# EAGLE design gba-zero (EAGLE 9.0.0)
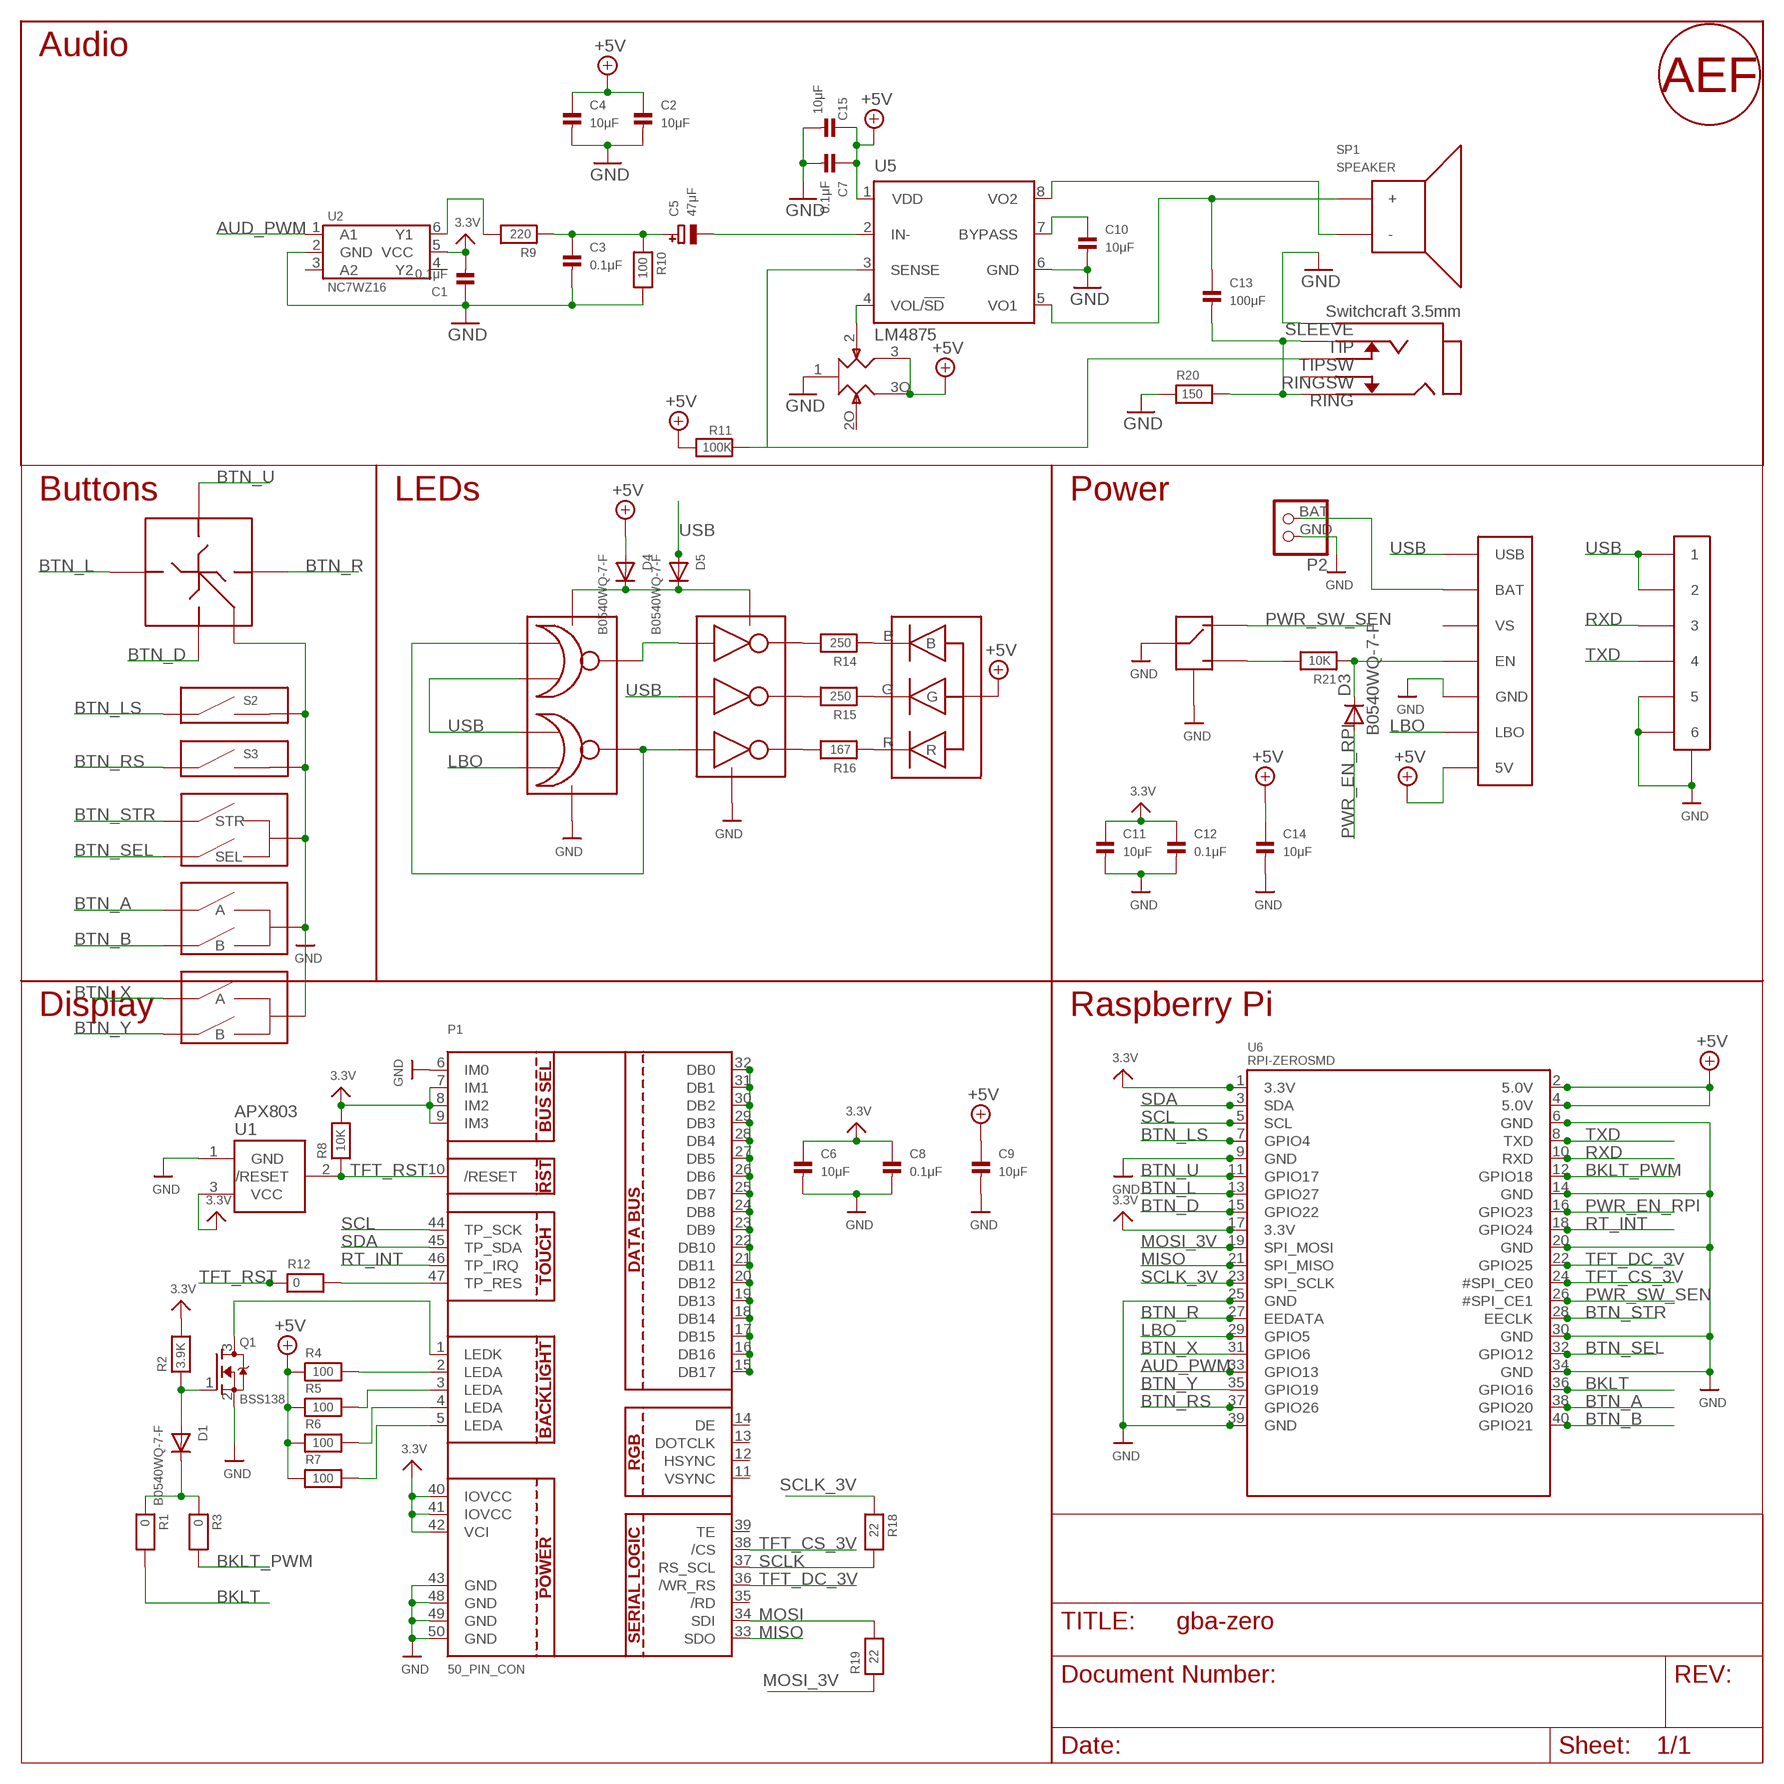
[diagram p0: schematic, sheet 1]

## Parts
C1  0.1μF  CAP_CERAMIC0603  [0603]
C2  10μF  CAP_CERAMIC0603  [0603]
C3  0.1μF  CAP_CERAMIC0603  [0603]
C4  10μF  CAP_CERAMIC0603  [0603]
C5  47μF  CAP_TANTALUMC/6032_REFLOW  [EIA6032-28/C-R]
C6  10μF  CAP_CERAMIC0603  [0603]
C7  0.1μF  CAP_CERAMIC0603  [0603]
C8  0.1μF  CAP_CERAMIC0603  [0603]
C9  10μF  CAP_CERAMIC0603  [0603]
C10  10μF  CAP_CERAMIC0603  [0603]
C11  10μF  CAP_CERAMIC0603  [0603]
C12  0.1μF  CAP_CERAMIC0603  [0603]
C13  100μF  CAP_CERAMIC1206  [1206]
C14  10μF  CAP_CERAMIC0603  [0603]
C15  10μF  CAP_CERAMIC0603  [0603]
D1  B0540WQ-7-F  DIODESOD-123  [SOD-123]
D2  LTST-C19HE1WT  [WL-SBCW-0606]
D3  B0540WQ-7-F  DIODESOD-123  [SOD-123]
D4  B0540WQ-7-F  DIODESOD-123  [SOD-123]
D5  B0540WQ-7-F  DIODESOD-123  [SOD-123]
J1  SWTCHCRFT_3.5JACK5-JACK-SMD  [4-JACK-SMD]
P1  50_PIN_CON  DISP_LCD_CTP28  [FPC-50-CON]
P2  JST_2PIN  [JSTPH2]
P3  LINK_CONNECTOR  [LINK_CONNECTOR]
Q1  BSS138  MOSFET-NWIDE  [SOT23-WIDE]
R1  0  RESISTOR0603  [0603]
R2  3.9K  RESISTOR0603  [0603]
R3  0  RESISTOR0603  [0603]
R4  100  RESISTOR0603  [0603]
R5  100  RESISTOR0603  [0603]
R6  100  RESISTOR0603  [0603]
R7  100  RESISTOR0603  [0603]
R8  10K  RESISTOR0603  [0603]
R9  220  RESISTOR0603  [0603]
R10  100  RESISTOR0603  [0603]
R11  100K  RESISTOR0603  [0603]
R12  0  RESISTOR0603  [0603]
R14  250  RESISTOR0603  [0603]
R15  250  RESISTOR0603  [0603]
R16  167  RESISTOR0603  [0603]
R17  10K  RK10J12E0A0A  [RK10J12E0A0A]
R18  22  RESISTOR0603  [0603]
R19  22  RESISTOR0603  [0603]
R20  150  RESISTOR0603  [0603]
R21  10K  RESISTOR0603  [0603]
S1  D-PAD  [D-PAD]
S2  SHOULDER_BUTTON  [SHOULDER_BUTTON]
S3  SHOULDER_BUTTON  [SHOULDER_BUTTON]
S4  START_SELECT_BUTTON  [START_SELECT_BUTTON]
S5  AB_BUTTON  [AB_BUTTON]
S6  PWR_SWITCH  [PWR-SWITCH]
S7  AB_BUTTON  [AB_BUTTON]
SP1  SPEAKER  [SPEAKER]
U1  APX803  AXP083-SAG  [SOT23]
U2  NC7WZ16  [SC-70-6]
U3  74LVC2G02  [TSSOP-8]
U4  74LVC3G04  [TSSOP-8]
U5  LM4875  [SO-8]
U6  RPI-ZEROSMD  [RPI-SMD]
U7  POWERBOOST-1000C  [POWERBOOST-1000C]
U$1  SIGNATURE  [SIGNATURE]

## Nets
3.3V: C1.2 C6.1 C8.1 C11.1 C12.1 P1.7(IM1) P1.8(IM2) P1.9(IM3) P1.40(IOVCC) P1.41(IOVCC) P1.42(VCI) R2.2 R8.2 U1.3(VCC) U2.5(VCC) U6.1(3.3V) U6.17(3.3V)
+5V: C2.1 C4.1 C7.1 C9.1 C14.1 C15.1 D2.VCC D4.A R4.1 R5.1 R6.1 R7.1 R11.2 R17.3 R17.3O U5.1(VDD) U6.2(5.0V) U6.4(5.0V) U7.5V
AUD_PWM: U2.1(A1) U6.33(GPIO13)
BAT: P2.BAT U7.BAT
BKLT: R1.2 U6.36(GPIO16)
BKLT_PWM: R3.2 U6.12(GPIO18)
BTN_A: S5.A@1(A) S5.A@2(A) U6.38(GPIO20)
BTN_B: S5.B@1(B) S5.B@2(B) U6.40(GPIO21)
BTN_D: S1.DOWN U6.15(GPIO22)
BTN_L: S1.LEFT U6.13(GPIO27)
BTN_LS: S2.SW U6.7(GPIO4)
BTN_R: S1.RIGHT U6.27(EEDATA)
BTN_RS: S3.SW U6.37(GPIO26)
BTN_SEL: S4.SEL U6.32(GPIO12)
BTN_STR: S4.STR U6.28(EECLK)
BTN_U: S1.UP U6.11(GPIO17)
BTN_X: S7.A@1(A) S7.A@2(A) U6.31(GPIO6)
BTN_Y: S7.B@1(B) S7.B@2(B) U6.35(GPIO19)
BYPASS: C10.1 U5.7(BYPASS)
GND: C1.1 C2.2 C3.2 C4.2 C6.2 C7.2 C8.2 C9.2 C10.2 C11.2 C12.2 C14.2 C15.2 J1.1 P1.6(IM0) P1.43(GND) P1.48(GND) P1.49(GND) P1.50(GND) P2.GND P3.5 P3.6 P3.GND@1(GND) P3.GND@2(GND) Q1.2(S) R10.2 R17.1 R20.1 S1.GND@1(GND) S1.GND@2(GND) S1.GND@3(GND) S1.GND@4(GND) S2.GND@1 S2.GND@2 S2.GND@3 S3.GND@1 S3.GND@2 S3.GND@3 S4.GND@1(GND) S4.GND@2(GND) S4.GND@3(GND) S4.GND@4(GND) S5.GND@1(GND) S5.GND@2(GND) S5.GND@3(GND) S5.GND@4(GND) S6.C@1(C) S6.C@2(C) S6.GND@1(GND) S6.GND@2(GND) S7.GND@1(GND) S7.GND@2(GND) S7.GND@3(GND) S7.GND@4(GND) U1.1(GND) U2.2(GND) U3.4(GND) U4.4(GND) U5.6(GND) U6.6(GND) U6.9(GND) U6.14(GND) U6.20(GND) U6.25(GND) U6.30(GND) U6.34(GND) U6.39(GND) U7.GND@1(GND) U7.GND@2(GND)
LBO: U3.6(2B) U6.29(GPIO5) U7.LBO
MISO: P1.33(SDO) U6.21(SPI_MISO)
MOSI: P1.34(SDI) R19.2
MOSI_3V: R19.1 U6.19(SPI_MOSI)
N$1: P1.1(LEDK) Q1.3(D)
N$2: P1.5(LEDA) R7.2
N$3: P1.4(LEDA) R6.2
N$4: P1.3(LEDA) R5.2
N$5: R16.2 U4.2(3Y)
N$6: D1.C R1.1 R3.1
N$7: D1.A Q1.1(G) R2.1
N$8: D2.R R16.1
N$9: P1.15(DB17) P1.16(DB16) P1.17(DB15) P1.18(DB14) P1.19(DB13) P1.20(DB12) P1.21(DB11) P1.22(DB10) P1.23(DB9) P1.24(DB8) P1.25(DB7) P1.26(DB6) P1.27(DB5) P1.28(DB4) P1.29(DB3) P1.30(DB2) P1.31(DB1) P1.32(DB0)
N$10: P1.2(LEDA) R4.2
N$11: R15.2 U4.5(2Y)
N$12: D2.G R15.1
N$13: R14.2 U4.7(1Y)
N$14: D2.B R14.1
N$15: U3.7(1Y) U4.1(1A)
N$16: U3.1(1A) U3.3(2Y) U4.6(3A)
N$17: R21.2 S6.R
N$18: D3.C R21.1 U7.EN
N$19: D4.C D5.C U3.8(VCC) U4.8(VCC)
N$20: R9.2 U2.6(Y1)
N$21: C3.1 C5.+ R9.1 R10.1
N$22: P1.47(TP_RES) R12.2
N$23: C5.- U5.2(IN-)
PWR_EN_RPI: D3.A U6.16(GPIO23)
PWR_SW_SEN: S6.L U6.26(#SPI_CE1)
RING: C13.2 J1.2 J1.3 R20.2
RT_INT: P1.46(TP_IRQ) U6.18(GPIO24)
RXD: P3.3 U6.10(RXD)
SCL: P1.44(TP_SCK) U6.5(SCL)
SCLK: P1.37(RS_SCL) R18.2
SCLK_3V: R18.1 U6.23(SPI_SCLK)
SDA: P1.45(TP_SDA) U6.3(SDA)
SENSE: J1.5 R11.1 U5.3(SENSE)
TFT_CS_3V: P1.38(/CS) U6.24(#SPI_CE0)
TFT_DC_3V: P1.36(/WR_RS) U6.22(GPIO25)
TFT_RST: P1.10(/RESET) R8.1 R12.1 U1.2(/RESET)
TXD: P3.4 U6.8(TXD)
USB: D5.A P3.1 P3.2 U3.2(1B) U3.5(2A) U4.3(2A) U7.USB
VO1: C13.1 SP1.1(+) U5.5(VO1)
VO2: SP1.2(-) U5.8(VO2)
VOL/SD: R17.2 U5.4(VOL/!SD)
Unconnected: J1.4 P1.11(VSYNC) P1.12(HSYNC) P1.13(DOTCLK) P1.14(DE) P1.35(/RD) P1.39(TE) R17.2O U2.3(A2) U2.4(Y2) U7.VS

## Notes on the sheet
- Audio
- Buttons | LEDs | Power
- Display | Raspberry Pi

## Library data of the parts
C1-C4 C6-C15 = microbuilder:CAP_CERAMIC: Ceramic Capacitors 0402 - 0402 Surface Mount Capacitors 16pF 50V 5% [Digikey: 445-4899-2-ND] 18pF 50V 5% [Digikey: 490-1281-2-ND] 22pF 50V 5% [Digikey: 490-1283-2-ND] 68pF 50V 5% [Digikey: 490-1289-2-ND] 0.1uF 10V 10% [Digikey: 490-1318-2-ND] 1.0uF 6.3V 10% [Digikey: 490-1320-2-ND] 0603 - 0603 Surface Mount Capacitors 16 pF 50V 5% [Digikey: 445-5051-2-ND] 22 pF 50V [Digikey: PCC220ACVTR-ND] 33 pF 50V 5% [Digikey: 490-1415-1-ND] 56pF 50V 5% [Digikey: 490-1421-1-ND] 220pF 50V 5% [Digikey: 445-1285-1-ND] 680 pF 50V 2200 pF 50V 5% C0G [Digikey: 445-1297-1-ND] 5600 pF 100V 5% X7R [Digikey: 478-3711-1-ND] 0.1 µF 25V 10% [Digikey: PCC2277TR-ND] 0.22 µF 16V 10% X7R [Digikey: 445-1318-1-ND] 1.0 µF 25V 10% [Digikey: 445-5146-2-ND] 0603 - RF Specific 3pF 250V +/-0.1pF RF [Digikey: 712-1347-1-ND] 18 pF 250V 5% [Digikey: 478-3505-1-ND or 712-1322-1-ND] 56 pF 250V 5% C0G RF [Digikey: 490-4867-1-ND] 68 pF 250V RF [Digikey: 490-4868-1-ND] 0805 - 0805 Surface Mount Capacitors 220 pF 250V 2% RF Ceramic Capacitor [Digikey: 712-1398-1-ND] 1000 pF 50V 2% NP0 Ceramic Capacitor [Digikey: 478-3760-1-ND] 0.1 µF 25V 10% Ceramic Capacitor [Digikey: PCC1828TR-ND] 1.0 µF 16V 10% Ceramic Capacitor[Digikey: 490-1691-2-ND] 10.0 µF 10V 10% Ceramic Capacitor[Digikey: 709-1228-1-ND] 10.0 uF 16V 10% Ceramic Capacitor [Digikey: 478-5165-2-ND] 47 uF 6.3V 20% Ceramic Capacitor [Digikey: 587-1779-1-ND or 399-5506-1-ND] 1206 - 1206 Surface Mount Capacitors 47uF 10V 20% Ceramic Capacitor [Digikey: 490-5528-1-ND or 399-5508-1-ND or 445-6010-1-ND] 100uF 6.3V -20%, +80% Y5V Ceramic Capacitor (Digikey: 490-4512-1-ND, Mouser: 81-GRM31CF50J107ZE1L)
C5 = microbuilder:CAP_TANTALUM: Tantalum Capacitors Wave footprints have larger pads and are meant to be used for hand soldering. Reflow footprints are optimised for solder paste and a reflow oven. EIA3216-18/A-[R/W] - Size A / 3216-18 / 1206 footprint 4.7µF 25V 10% Tantalum Capacitor 10µF 16V 10% Tantalum Capacitor [Digikey: 495-2236-2-ND] EIA3528-21/B-[R/W] - Size B / 3528-21 47µF 10V 10% Tantalum Capactior [Digikey: 495-2216-1-ND] EIA6032-28/C-[R/W] - Size C / 6032-28 10µF 35V 20% Tantalum Capacitor [Digikey: 495-2285-1-ND] 100µF 16V 10% Tantalum Capactior [Digikey: 399-5214-1-ND]
D1 D3-D5 = microbuilder:DIODE: Diode SMA Model Volts Amps Type Vf Vr Digikey # Notes SSA34-E3 40V 3A Schottky 480mV @ 3A 200uA @ 40V SSA34-E3/61TGITR-ND CDBA120-G 20V 1A Schottky 500mV @ 1A 500uA @ 20V 641-1014-6-ND REEL MBRA210 10V 2A Schottky 350mV @ 2A 700uA @ 10V MBRA210LT3 SOD-123 Model Volts Amps Type Vf Vr Order # Notes BAT54T1G 30V 200mA Schottky 800mV @ 200mA 2uA @ 25V BAT54T1GOSTR-ND B0530W 30V 500mA Schottky 430mV @ 500mA 130uA @ 30V B0530W-FDICT-ND REEL MBR120 1A 20V Schottky 340mV @ 1A MBR120VLSFT1GOSCT-ND SOD-323 Model Volts Amps Type Vf Vr Order # Notes PMEG2005EJ 20V 500mA Schottky 355mV @ 500mA 568-4110-1-ND ZLLS410 10V 570mA Schottky 380mV @ 570mA ZLLS410CT-ND 1N4148WS 75V 150mA Silicon/Simple 1V 1N4148WSFSCT-ND REEL SOD-523 Model Volts Amps Type Vf Vr Order # Notes BAT54XV2 30V 200mA Schottky 0.8V @ 100mA BAT54XV2CT-ND TB751S 30V 30mA Schottky RB751S-40TE61CT-ND SOT23-R/W (R = Solder Paste/Reflow Ovens, W = Hand-Soldering) Model Volts Amps Type Vf Vr Order # Notes BAT54FILM 40V 300mA Schottky 497-7162-1-ND
D2 = gba-zero-parts:LTST-C19HE1WT
J1 = gba-zero-parts:SWTCHCRFT_3.5JACK: Switchcraft 3.5mm Stereo Audio Jack manufacturer: 35RASMT4BHNTRX digikey: SC1488-1-ND
P1 = gba-zero-parts:DISP_LCD_CTP28: 2.83" 240x320 Pixel Capacitive Touch Display
P2 = gba-zero-parts:JST_2PIN: JST 2-Pin Right-Angle Connector PH-Series - 4UConnector: 17311 SH-Series - 4UConnector: 07278
P3 = gba-zero-parts:LINK_CONNECTOR
Q1 = microbuilder:MOSFET-N: N-Channel Mosfet LEGEND VDS: Voltage Drain-Source ID: Drain Current RDS(ON): Drain-Source On-State Resistance VGS(TH): Gate-Source Threshold Voltage CISS: Drain-Source Input Capacitance SOT-23 Name VDS ID RDS(ON) VGS(TH) CISS Order Number 2N7002E 60V 260mA 2.5 Ohm 2.5V @ 250uA 26.7pF @ 25V 2N7002ET1GOSTR-ND BSH103 30V 850mA 400 mOhm 400mV @ 1mA 83pF @ 24V BSH103,235-ND BSS138 60V 320mA 1.6 Ohm 1.5V @ 250uA 50pF @ 10V Mouser: 771-BSS138PW115 DMN2075U-7 20V 4.2A 38 mOhm 1V @ 250 uA 594.3pF @ 10V DMN2075U-7DICT-ND * BSS138 good choice for I2C level-shifting
R1-R12 R14-R16 R18-R21 = microbuilder:RESISTOR: Resistors 0402 - 0402 Surface Mount Package 22 Ohm 1% 1/16W [Digikey: 311-22.0LRTR-ND] 33 Ohm 5% 1/16W 1.0K 5% 1/16W 1.5K 5% 1/16W 2.0K 1% 1/16W 10.0K 1% 1/16W [Digikey: 311-10.0KLRTR-ND] 10.0K 5% 1/16W [Digikey: RMCF0402JT10K0TR-ND] 12.1K 1% 1/16W [Digikey: 311-22.0LRTR-ND] 100.0K 5% 1/16W 0603 - 0603 Surface Mount Package 0 Ohm 1/10 Watt 1% Resistor 15 Ohm 1/10 Watt 1% Resistor 33 Ohm 1/10 Watt 1% Resistor 49.9 Ohm 1/10 Watt 1% Resistor 100 Ohm 1/10 Watt 1% Resistor 150 Ohm 1/10 Watt 1% Resistor 240 Ohm 1/10 Watt 1% Resistor 390 Ohm 1/10 Watt 1% Resistor 560 Ohm 1/10 Watt 1% Resistor 680 Ohm 1/10 Watt 1% Resistor 750 Ohm 1/10 Watt 1% Resistor 1.0K Ohm 1/10 Watt 1% Resistor 1.5K Ohm 1/10 Watt 1% Resistor 2.0K Ohm 1/10 Watt 1% Resistor 2.2K Ohm 1/10 Watt 1% Resistor 3.3K Ohm 1/10 Watt 1% Resistor 4.7K Ohm 1/10 Watt 1% Resistor 10.0K Ohm 1/10 Watt 1% Resistor 12.0K Ohm 1/10 Watt 1% Resistor 12.1K Ohm 1/10 Watt 1% Resistor 20.0K Ohm 1/10 Watt 1% Resistor 33.0K Ohm 1/10 Watt 1% Resistor 100.0K Ohm 1/10 Watt 1% Resistor 0805 - 0805 Surface Mount Package 0 Ohm 1/8 Watt 1% Resistor 33 Ohm 1/8 Watt 1% Resistor 100 Ohm 1/8 Watt 1% Resistor 150 Ohm 1/8 Watt 1% Resistor 200 Ohm 1/8 Watt 1% Resistor 240 Ohm 1/8 Watt 1% Resistor 330 Ohm 1/8 Watt 1% Resistor 390 Ohm 1/8 Watt 1% Resistor 470 Ohm 1/8 Watt 1% Resistor 1.0K Ohm 1/8 Watt 1% Resistor 1.5K Ohm 1/8 Watt 1% Resistor 2.0K Ohm 1/8 Watt 1% Resistor 4.7K Ohm 1/8 Watt 1% Resistor 5.1K Ohm 1/8 Watt 1% Resistor 5.6K Ohm 1/8 Watt 1% Resistor 10.0K Ohm 1/8 Watt 1% Resistor 22.0K Ohm 1/8 Watt 1% Resistor 33.0K Ohm 1/8 Watt 1% Resistor 100K Ohm 1/8 Watt 1% Resistor 1206 - 1206 Surface Mount Package 2012 - 2010 Surface Mount Package 0.11 Ohm 1/2 Watt 1% Resistor - Digikey: RHM.11UCT-ND
R17 = gba-zero-parts:RK10J12E0A0A
S1 = gba-zero-parts:D-PAD
S2 S3 = gba-zero-parts:SHOULDER_BUTTON
S4 = gba-zero-parts:START_SELECT_BUTTON
S5 = gba-zero-parts:AB_BUTTON
S6 = gba-zero-parts:PWR_SWITCH
S7 = gbz master:AB_BUTTON
SP1 = GBA:SPEAKER
U1 = adafruit:AXP083
U2 = fairchild:NC7WZ16
U3 = gba-zero-parts:74LVC2G02
U4 = gba-zero-parts:74LVC3G04
U5 = gba-zero-parts:LM4875: LM4875 Boomer Audio Power Amplifier 750mW - with DC Volume Control and Headphone Switch
U6 = gba-zero-parts:RPI-ZERO
U7 = gba-zero-parts:POWERBOOST-1000C
U$1 = gba-zero-parts:SIGNATURE

## Net classes
1 power: width 0.279 mm

## Board
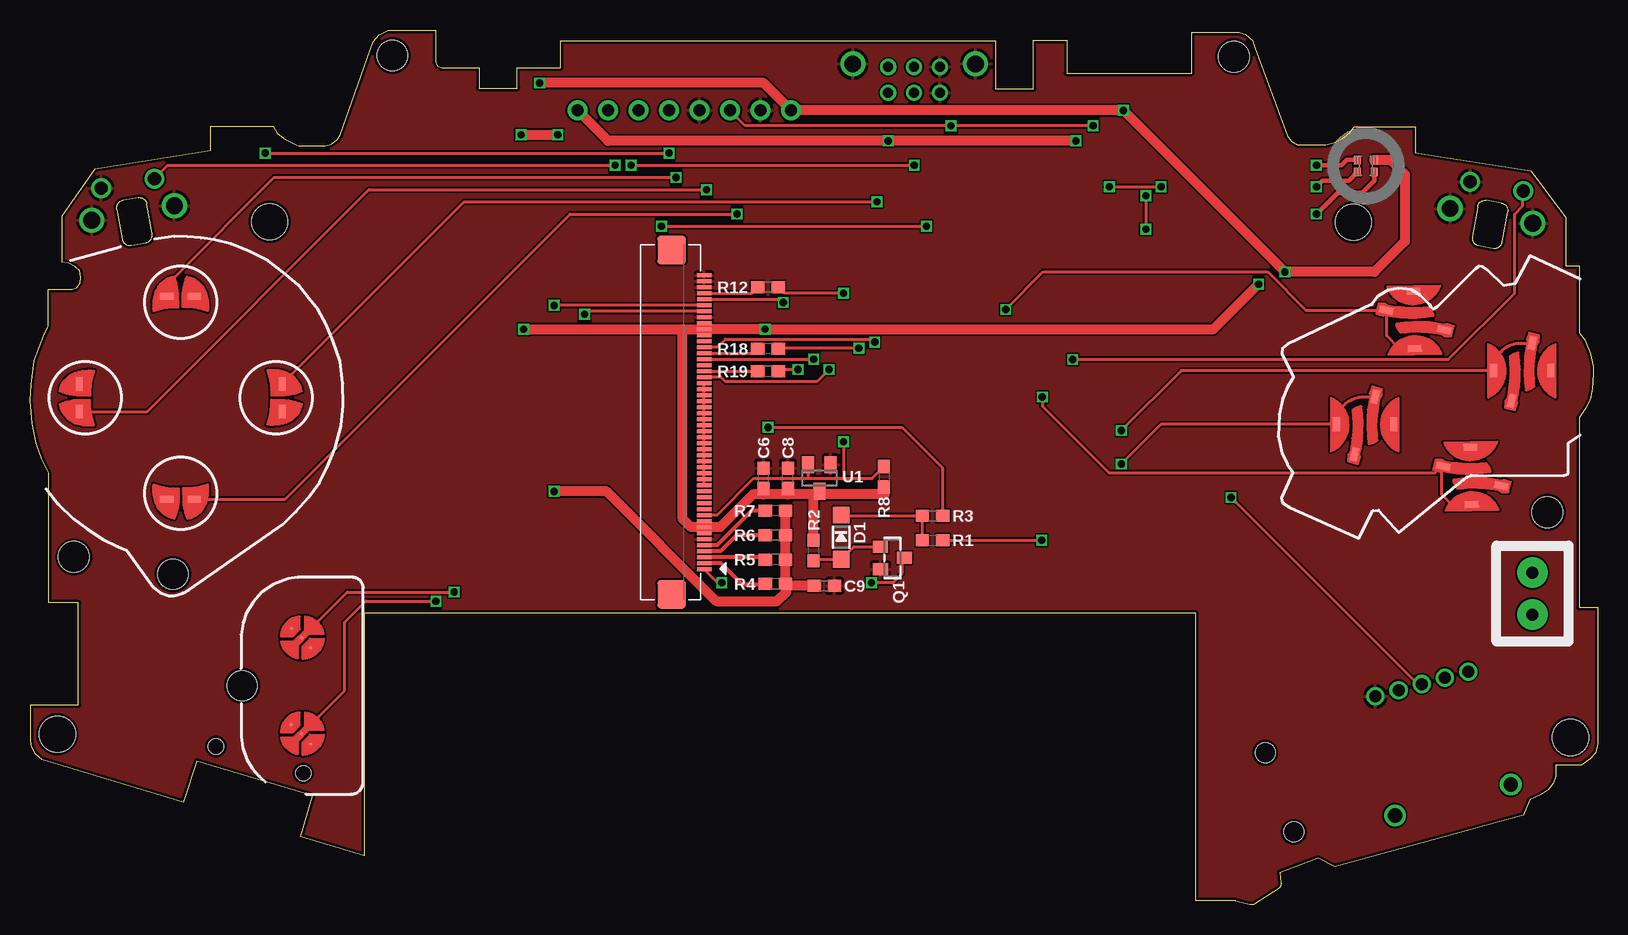
[diagram p1: board, top side]
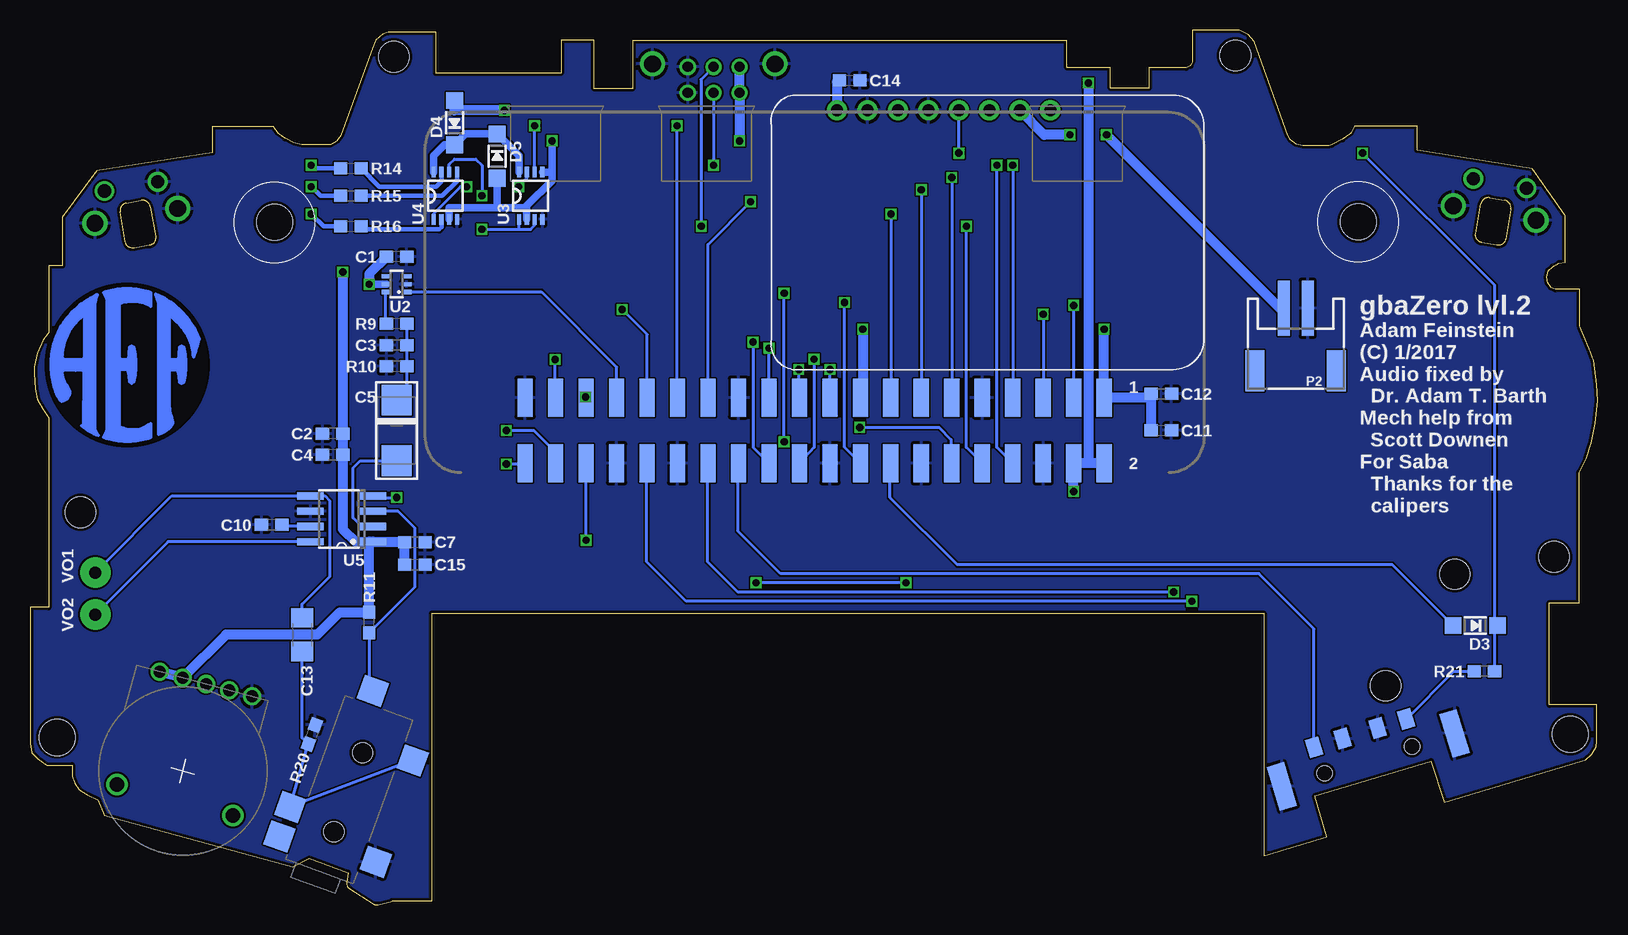
[diagram p2: board, bottom side, seen from below]

Size 130.69 x 72.91 mm. Coordinates in mm from the lower left corner, seen from the top.
Outline: 44.23,72 80.47,72 80.47,68.02 83.66,68.02 83.66,72.06 86.44,72.06 86.44,69.33 96.85,69.33 96.85,72.72 100.82,72.72 101.3,72.55 101.88,72.06 102.12,71.43 104.81,64.08 105.13,63.65 105.63,63.36 108.03,63.36 108.7,63.53 109.43,63.87 109.99,64.31 110.39,64.87 115.48,64.87 115.48,62.69 125.12,61.16 128,57.31 128,53.27 129.14,53.27 129.14,47.69 129.6,47.09 130.07,45.98 130.33,44.87 130.33,44.25 130.25,43 130.07,42.15 129.64,41.33 129.14,40.6 129.14,24.79 130.69,24.79 130.69,13.46 130.53,12.69 130.04,12.17 129.31,11.66 127.18,11.66 127.18,10.71 126.98,10.16 126.58,9.6 125.93,9.17 125.03,8.75 124.58,7.66 124.5,7.46 108.77,3.2 107.4,3.87 104.17,2.69 104.29,1.85 arc-65 104.06,1.36 102.09,0.08 arc-48 101.69,0.02 100.5,0.33 arc15 100.38,0.34 97.18,0.34 97.18,24.3 27.85,24.3 27.85,4.08 22.58,5.68 23.57,9.1 13.91,11.99 12.78,8.58 1.02,12.09 0.5,12.55 0.14,13.19 0.07,13.63 0.07,16.67 4.04,16.67 4.04,25.16 1.56,25.16 1.56,36.03 0.97,37.18 0.54,38.48 0.19,40.16 0,42.04 0.08,43.4 0.34,45.37 0.72,46.37 1.16,47.43 1.47,48.14 1.51,48.23 1.51,51.3 3.52,51.3 3.89,51.45 4.19,51.84 4.23,52.3 4.14,52.86 3.76,53.2 3.24,53.48 2.71,53.57 2.71,57.43 5.44,61.36 15.06,62.91 15.06,64.9 20.28,64.9 20.6,64.32 21.28,63.8 22.18,63.35 22.4,63.28 24.6,63.28 25.12,63.41 25.61,63.75 25.86,64.14 28.62,71.95 29.12,72.52 29.87,72.91 33.8,72.91 33.8,70.26 33.95,69.93 34.31,69.76 37.44,69.76 37.44,68.06 40.62,68.06 40.62,69.78 44.24,69.78 44.23,72
Copper layers (1*16): Top 0.035mm / dielectric 1.5mm / Bottom 0.035mm
Design rules "SeeedStudio_2layer_DRU_no_angle_20140221": minimum track width 6mil, minimum drill 12mil, track to track 6mil, track to pad 6mil, pad to pad 6mil, via to via 6mil, smd to smd 0mil, copper to edge 10mil, drill to drill 10mil, minimum pad ring 10mil, minimum via ring 6mil, stop-mask expansion 2mil, vias tented up to drill 100mil, thermal gap 10mil
Holes 3 mm at 2.29,14.23 19.97,56.94 110.31,56.88 128.41,13.96
Holes 2.54 mm at 30.21,70.79 100.36,70.69 3.65,29.01 126.49,32.72
Holes 2.5 mm at 17.7,18.27 11.92,27.56

### Footprints (pad centres in the part's own frame; a part is rotated, then mirrored left to right if it is on the bottom)
0603 = smd 1.1 x 1: 1 -0.85,0; 2 0.85,0
EIA6032-28/C-R = smd 2.55 x 2.5: + 2.525,0; - -2.525,0
1206 = smd 1.6 x 1.8: 1 -1.4,0; 2 1.4,0
SOD-123 = smd 1.4 x 1.4: A 1.85,0; C -1.85,0
WL-SBCW-0606 = smd 0.6 x 0.7: B 0.7,-0.5; G 0.7,0.5; R -0.7,0.5; VCC -0.7,-0.5
4-JACK-SMD = smd 2.108 x 2.108: 1 2.362,-1.143; 2 4.216,7.137; 3 11.354,-1.143; 4 1.6,7.137; 5 15.672,3.962 | hole 1.651: 3.505,2.997; 10.516,2.997
FPC-50-CON = smd 0.3 x 1.2: 1 12.25,2.65; 2 11.75,2.65; 3 11.25,2.65; 4 10.75,2.65; 5 10.25,2.65; 6 9.75,2.65; 7 9.25,2.65; 8 8.75,2.65; 9 8.25,2.65; 10 7.75,2.65; 11 7.25,2.65; 12 6.75,2.65; 13 6.25,2.65; 14 5.75,2.65; 15 5.25,2.65; 16 4.75,2.65; 17 4.25,2.65; 18 3.75,2.65; 19 3.25,2.65; 20 2.75,2.65; 21 2.25,2.65; 22 1.75,2.65; 23 1.25,2.65; 24 0.75,2.65; 25 0.25,2.65; 26 -0.25,2.65; 27 -0.75,2.65; 28 -1.25,2.65; 29 -1.75,2.65; 30 -2.25,2.65; 31 -2.75,2.65; 32 -3.25,2.65; 33 -3.75,2.65; 34 -4.25,2.65; 35 -4.75,2.65; 36 -5.25,2.65; 37 -5.75,2.65; 38 -6.25,2.65; 39 -6.75,2.65; 40 -7.25,2.65; 41 -7.75,2.65; 42 -8.25,2.65; 43 -8.75,2.65; 44 -9.25,2.65; 45 -9.75,2.65; 46 -10.25,2.65; 47 -10.75,2.65; 48 -11.25,2.65; 49 -11.75,2.65; 50 -12.25,2.65 | smd 2.4 x 2.4: PAD1 14.35,-0.06; PAD2 -14.35,-0.06
JSTPH2 = smd 1 x 4.6: BAT 1,-3.7; GND -1,-3.7 | smd 1.6 x 3.4: NC1 -3.4,1.5; NC2 3.4,1.5
LINK_CONNECTOR = drill 0.838: 1 -2.159,2.159; 2 -2.159,0; 3 0,2.159; 4 0,0; 5 2.159,2.159; 6 2.159,0 | drill 1.397 pad 1.905: GND@1 -5.105,2.413; GND@2 5.105,2.413
SOT23-WIDE = smd 1 x 1.27: 1 -0.95,-1; 2 0.95,-1; 3 0,1
RK10J12E0A0A = drill 1: 1 -4,0; 2 0,0; 2O -2,0; 3 2,0; 3O 4,0 | drill 1.2: P$6 -5,10; P$7 5,10
D-PAD = smd 1.039 x 0.574: DOWN 1.149,-8.444; GND@1 1.149,8.444 | smd 0.574 x 1.149: GND@2 -8.444,1.149; GND@4 8.444,-1.149; LEFT -8.444,-1.149; RIGHT 8.444,1.149 | smd 1.149 x 0.574: GND@3 -1.149,-8.444; UP -1.149,8.444
SHOULDER_BUTTON = drill 1.4: GND@1 -3.5,0; GND@3 3.5,0 | drill 1.1: GND@2 -2.25,2.5; SW 2.25,2.5
START_SELECT_BUTTON = smd 0.23 x 0.23 rotated 45: GND@1 -0.919,-3.263; GND@2 0.689,-4.871; GND@3 -0.896,4.756; SEL -0.069,-4.021; STR -0.046,3.998 | smd 0.23 x 0.23 rotated 135: GND@4 0.712,3.148
AB_BUTTON = smd 0.574 x 1.149: A@1 4.182,2.298; B@1 -8.915,-2.183; GND@2 -4.136,-2.183; GND@4 8.961,2.298 | smd 1.149 x 0.574 rotated 77: A@2 7.422,4.595; B@2 -5.675,0.115; GND@1 -7.399,-4.687; GND@3 5.698,-0.207
PWR-SWITCH = smd 1.143 x 1.6: C@1 -1.524,2.324; C@2 1.524,2.324; L -4.013,2.324; R 4.013,2.324 | smd 1.473 x 3.81: GND@1 -7.531,0; GND@2 7.531,0 | hole 1.27: -3.81,0; 3.81,0
SPEAKER = drill 1 pad 2.54: 1 -1.75,0; 2 1.75,0
SOT23 = smd 1 x 1.4: 1 -0.95,-1.1; 2 0.95,-1.1; 3 0,1.1
SC-70-6 = smd 0.8 x 0.35: 1 -0.85,0.65; 2 -0.85,0; 3 -0.85,-0.65; 4 0.85,-0.65; 5 0.85,0; 6 0.85,0.65
TSSOP-8 = smd 0.9 x 0.35: 1 -1.975,0.975; 2 -1.975,0.325; 3 -1.975,-0.325; 4 -1.975,-0.975; 5 1.975,-0.975; 6 1.975,-0.325; 7 1.975,0.325; 8 1.975,0.975
SO-8 = smd 2.2 x 0.6: 1 -2.6,1.905; 2 -2.6,0.635; 3 -2.6,-0.635; 4 -2.6,-1.905; 5 2.6,-1.905; 6 2.6,-0.635; 7 2.6,0.635; 8 2.6,1.905
RPI-SMD = smd 1.27 x 3.175: 1 -24.13,-2.731; 2 -24.13,2.731; 3 -21.59,-2.731; 4 -21.59,2.731; 5 -19.05,-2.731; 6 -19.05,2.731; 7 -16.51,-2.731; 8 -16.51,2.731; 9 -13.97,-2.731; 10 -13.97,2.731; 11 -11.43,-2.731; 12 -11.43,2.731; 13 -8.89,-2.731; 14 -8.89,2.731; 15 -6.35,-2.731; 16 -6.35,2.731; 17 -3.81,-2.731; 18 -3.81,2.731; 19 -1.27,-2.731; 20 -1.27,2.731; 21 1.27,-2.731; 22 1.27,2.731; 23 3.81,-2.731; 24 3.81,2.731; 25 6.35,-2.731; 26 6.35,2.731; 27 8.89,-2.731; 28 8.89,2.731; 29 11.43,-2.731; 30 11.43,2.731; 31 13.97,-2.731; 32 13.97,2.731; 33 16.51,-2.731; 34 16.51,2.731; 35 19.05,-2.731; 36 19.05,2.731; 37 21.59,-2.731; 38 21.59,2.731; 39 24.13,-2.731; 40 24.13,2.731
POWERBOOST-1000C = drill 1 pad 1.676: 5V 30.607,1.27; BAT 15.367,1.27; EN 20.447,1.27; GND@1 22.987,1.27; GND@2 28.067,1.27; LBO 25.527,1.27; USB 12.827,1.27; VS 17.907,1.27

### Placement (x,y rotation side)
C1  100.13,54.02 180 bottom
C2  105.46,39.29 180 bottom
C3  100.13,46.65 180 bottom
C4  105.46,37.51 180 bottom
C5  100.13,39.54 90 bottom
C6  61.14,35.55 90 top
C7  98.61,30.24 0 bottom
C8  63.17,35.55 90 top
C9  66.22,26.59 0 top
C10  110.54,31.67 180 bottom
C11  36.38,39.54 0 bottom
C12  36.38,42.59 0 bottom
C13  108,22.52 270 bottom
C14  62.36,68.71 0 bottom
C15  98.61,28.36 0 bottom
D1  67.62,30.65 270 top
D2  111.35,61.59 180 top
D3  10.21,23.28 180 bottom
D4  95.3,65.19 90 bottom
D5  91.75,62.4 270 bottom
J1  103.74,1.76 70 bottom
P1  53.55,40.23 270 top
P2  25.18,46.02 180 bottom
P3  73.7,67.67 0 top
Q1  71.89,28.91 270 top
R1  75.24,30.4 0 top
R2  65.33,29.53 90 top
R3  75.24,32.43 0 top
R4  62.13,26.75 180 top
R5  62.13,28.79 180 top
R6  62.13,30.82 180 top
R7  62.13,32.85 180 top
R8  71.17,35.68 270 top
R9  100.13,48.43 180 bottom
R10  100.13,44.87 180 bottom
R11  102.42,23.54 90 bottom
R12  61.52,51.48 180 top
R14  103.94,61.38 0 bottom
R15  103.94,59.1 0 bottom
R16  103.94,56.56 0 bottom
R17  116.02,18.41 165 bottom
R18  61.52,46.35 180 top
R19  61.52,44.47 180 top
R20  107.2,14.2 250 bottom
R21  9.45,19.47 180 bottom
S1  12.56,42.27 0 top
S2  8.59,57.66 10 top
S3  121.83,57.42 350 top
S4  22.7,18.28 0 top
S5  117.81,42.23 0 top
S6  19.13,12.09 17 bottom
S7  117.81,42.23 91.2 top
SP1  125.24,25.95 270 top
U1  65.8,35.58 180 top
U2  100.13,51.73 180 bottom
U3  88.95,59.1 90 bottom
U4  96.07,59.1 90 bottom
U5  104.7,32.17 180 bottom
U6  65.28,39.54 180 bottom
U7  32.82,67.48 180 bottom
U$1  122.76,45 0 bottom

### Tracks (layer width: path | path; a pad name or v marks a point on that pad's centre or on a via)
3.3V  (via drill 0.6)
  Top 0.356: P1.42 P1.41 P1.40 | P1.7 P1.8 P1.9
  Top 0.508: R8.2 71.26,34.21 | U1.3 65.8,34.21 | 61.14,34.21 C6.1 | C8.1 63.17,34.21
  Top 0.813: v41.15,47.98 54.41,47.98 | 54.41,47.98 P1.41 v61.27,47.98 98.66,47.98 v102.42,51.73 | 71.26,34.21 65.8,34.21 65.33,34.21 | 65.33,34.21 63.17,34.21 61.14,34.21 60.25,34.21 57.52,31.48 P1.8 55.11,31.48 54.41,32.17 54.41,47.98 | R2.2 65.33,34.21
  Bottom 0.508: 61.27,42.52 U6.17 | C12.1 37.64,42.27
  Bottom 0.635: U2.5 v102.42,51.73
  Bottom 0.813: v41.15,47.98 U6.1 37.64,42.27 | C11.1 C12.1 | v61.27,47.98 61.27,42.52 | C1.2 102.42,52.58 v102.42,51.73
+5V  (via drill 0.6)
  Top 0.508: R7.1 63.08,32.94 | 63.05,26.08 63.05,26.72 R4.1 63.25,26.59
  Top 0.813: R4.1 R5.1 R6.1 R7.1 | v42.47,68.5 61.14,68.5 U7.5V v91.15,66.21 v104.61,52.75 112.07,52.75 114.61,55.29 114.61,60.88 113.39,62.09 D2.VCC | 63.05,26.08 62.28,25.32 57.2,25.32 48.06,34.46 v43.69,34.46 | C9.1 63.25,26.59
  Bottom 0.508: C14.1 arc-90 63.43,68.59
  Bottom 0.813: U6.2 42.47,36.81 | 42.47,36.81 U6.4 v43.69,34.46 | v42.47,68.5 42.47,36.81 | 63.43,68.59 U7.5V | R17.3O R17.3 114.35,22.52 106.73,22.52 104.87,24.39 R11.2 102.42,30.27 U5.1 | C15.1 C7.1 99.46,30.27 U5.1 | v104.61,52.75 C2.1 C4.1 104.61,31.32 103.56,30.27 U5.1 | v91.15,66.21 95.3,66.21 D4.A
AUD_PWM
  Bottom 0.254: U6.33 81.79,44.82 88.05,51.08 U2.1
BAT  (via drill 0.6)
  Top 0.813: v40.95,64.18 v44,64.18
  Bottom 0.508: P2.BAT 26.49,49.72
  Bottom 0.813: 26.49,49.72 v40.95,64.18 | v44,64.18 46.15,64.18 U7.BAT
BKLT  (via drill 0.6)
  Top 0.254: R1.2 v84.33,30.4
  Bottom 0.254: v84.33,30.4 U6.36
BKLT_PWM  (via drill 0.6)
  Top 0.254: R3.2 76.09,36.4 72.7,39.79 v61.52,39.79
  Bottom 0.254: v61.52,39.79 54.92,39.79 53.9,38.78 53.9,36.86 U6.12
BTN_A  (via drill 0.6)
  Top 0.254: S5.A@2 124.29,46.83 arc90 S5.A@1 95.98,44.53 v90.99,39.54
  Bottom 0.254: v90.99,39.54 88.7,39.54 86.92,37.76 86.92,36.86 U6.38
BTN_B  (via drill 0.6)
  Top 0.254: S5.B@2 111.19,42.35 arc90 S5.B@1 94.29,40.05 v90.99,36.75
  Bottom 0.254: v90.99,36.75 89.47,36.75 U6.40
BTN_D  (via drill 0.6)
  Top 0.254: S1.DOWN 21.26,33.82 45.01,57.57 v58.93,57.57
  Bottom 0.254: 58.47,42.73 U6.15 v58.93,57.57
BTN_L  (via drill 0.6)
  Top 0.254: S1.LEFT 9.76,41.12 28.25,59.61 v56.39,59.61
  Bottom 0.254: v56.39,59.61 U6.13
BTN_LS  (via drill 0.6)
  Top 0.254: v48.77,61.64 11.5,61.64 S2.SW
  Bottom 0.254: v48.77,61.64 U6.7
BTN_R  (via drill 0.6)
  Top 0.254: S1.RIGHT 36.18,58.59 v70.61,58.59
  Bottom 0.254: U6.27 74.17,55.03 v70.61,58.59
BTN_RS  (via drill 0.6)
  Top 0.254: S3.SW 124.43,59.44 124.43,58.25 123.75,57.57 123.75,50.97 118.24,45.46 v86.92,45.46
  Bottom 0.254: U6.37 86.92,42.27 v86.92,45.46
BTN_SEL  (via drill 0.6)
  Top 0.254: S4.SEL 26.22,17.85 26.22,23.54 27.99,25.32 v33.84,25.32
  Bottom 0.254: v33.84,25.32 76,25.32 79.3,28.62 79.3,36.76 U6.32
BTN_STR  (via drill 0.6)
  Top 0.254: S4.STR 26.45,26.08 v35.36,26.08
  Bottom 0.254: v35.36,26.08 71.68,26.08 74.22,28.62 74.22,36.76 U6.28
BTN_U  (via drill 0.6)
  Top 0.254: S1.UP 11.99,51.29 11.99,52.24 20.37,60.62 v53.85,60.62
  Bottom 0.254: v53.85,60.62 U6.11
BTN_X  (via drill 0.6)
  Top 0.254: v81.33,49.62 84.46,52.75 103.18,52.75 106.37,49.55 S7.A@2 113.08,49.53 113.08,47.41 114.13,46.36 S7.A@1
  Bottom 0.254: U6.31 79.25,47.54 v81.33,49.62
BTN_Y  (via drill 0.6)
  Top 0.152: v84.38,42.33 84.38,42.08
  Top 0.254: 117.66,36.55 S7.B@2 | 84.38,42.08 84.38,41.57 89.94,36.01 117.11,36.01 117.66,36.55 | S7.B@1 120.02,33.52 118.34,33.52 117.66,34.21 117.66,36.55
  Bottom 0.152: U6.35 84.33,42.28 v84.38,42.33
BYPASS
  Bottom 0.254: U5.7 109.31,31.54 C10.1
GND
  pour Top: -1.72,0.17 130.86,0.17 130.86,73.07 -1.72,73.07
  pour Bottom: -1.72,0.17 130.86,0.17 130.86,73.07 -1.72,73.07
LBO  (via drill 0.6)
  Top 0.254: v88.63,64.94 v76.76,64.94 59.62,64.94 U7.LBO
  Bottom 0.254: U3.6 v88.63,64.94 | U6.29 76.76,42.32 v76.76,64.94
MISO  (via drill 0.6)
  Top 0.254: v66.6,44.62 65.59,43.6 57.97,43.6 57.59,43.98 P1.33
  Bottom 0.254: U6.21 66.6,42.32 v66.6,44.62
MOSI
  Top 0.254: P1.34 59.66,44.48 R19.2
MOSI_3V  (via drill 0.6)
  Top 0.254: v64.01,44.62 62.37,44.62 R19.1
  Bottom 0.254: U6.19 v64.01,44.62
N$1  (via drill 0.6)
  Top 0.254: Q1.3 72.7,28.72 72.7,27.6 71.94,26.84 v70.16,26.84 | v57.66,26.84 57.33,26.84 P1.1
  Bottom 0.254: v57.66,26.84 v70.16,26.84
N$2
  Top 0.33: R7.2 60.17,32.85 57.29,29.98 P1.5
N$3
  Top 0.33: R6.2 58.9,30.82 57.55,29.48 P1.4
N$4
  Top 0.254: R5.2 60.99,28.98
  Top 0.33: 60.99,28.98 P1.3
N$5
  Bottom 0.356: U4.2 96.39,56.49 96.57,56.3 102.84,56.3 R16.2
N$6
  Top 0.254: R1.1 R3.1 67.69,32.43 D1.C
N$7
  Top 0.254: R2.1 65.45,28.8 D1.A 68.68,29.86 Q1.1
N$8  (via drill 0.6)
  Top 0.356: D2.R 112.05,60.35 111.05,59.35 109.02,59.35 v107.24,57.57
  Bottom 0.356: R16.1 106.23,56.56 v107.24,57.57
N$9
  Top 0.254: P1.15 P1.16 P1.17 P1.18 P1.19 P1.20 P1.21 P1.22 P1.23 P1.24 P1.25 P1.26 P1.27 P1.28 P1.29 P1.30 P1.31 P1.32
N$10
  Top 0.254: 61.13,26.7 arc90 R4.2
  Top 0.33: 61.13,26.7 59.38,26.7 57.6,28.48 P1.2
N$11
  Bottom 0.356: U4.5 95.09,60.33 96.32,59.1 R15.2
N$12  (via drill 0.6)
  Top 0.356: D2.G 109.93,60.37 107.75,60.37 v107.24,59.86
  Bottom 0.356: v107.24,59.86 106.48,59.1 R15.1
N$13
  Bottom 0.356: U4.7 96.39,60.3 96.83,59.86 101.57,59.86 R14.2
N$14  (via drill 0.6)
  Top 0.356: D2.B 109.78,62.09 109.33,61.64 v107.24,61.64
  Bottom 0.356: v107.24,61.64 106.99,61.38 R14.1
N$15  (via drill 0.6)
  Top 0.254: v89.97,59.86 v94.29,59.86
  Bottom 0.254: U3.7 89.28,60.55 v89.97,59.86 | U4.1 97.04,57.61 94.8,59.86 v94.29,59.86
N$16  (via drill 0.6)
  Top 0.254: v93.02,59.1 v93.02,56.3
  Bottom 0.254: 89.93,56.3 U3.1 | v93.02,56.3 89.93,56.3 | U4.6 95.74,61.71 95.3,62.15 93.53,62.15 93.02,61.64 v93.02,59.1 | 89.93,56.3 88.95,56.3 88.63,56.63 U3.3
N$17
  Bottom 0.254: S6.R 11.98,19.47 R21.2
N$18  (via drill 0.6)
  Top 0.254: v19.61,62.65 v53.27,62.65
  Bottom 0.254: v53.27,62.65 U7.EN | D3.C 8.6,22.78 R21.1 8.6,51.64 v19.61,62.65
N$19
  Bottom 0.635: U3.8 89.93,62.43 D5.C 94.4,64.25 D4.C 96.14,63.34 97.04,62.44 U4.8
N$20
  Bottom 0.254: R9.2 101.04,48.49 101.04,51.08 U2.6
N$21
  Bottom 0.254: R9.1 C3.1 R10.1 99.28,42.91 C5.+
N$22
  Top 0.254: P1.47 60.17,50.98 R12.2
N$23
  Bottom 0.254: U5.2 102.23,31.67 103.18,31.67 103.76,32.25 103.76,36.42 103.16,37.01 C5.-
PWR_EN_RPI
  Bottom 0.254: U6.16 58.98,36.76 58.98,33.95 53.39,28.36 17.14,28.36 D3.A
PWR_SW_SEN
  Bottom 0.254: U6.26 71.68,36.76 71.68,31.16 68.13,27.6 28.25,27.6 23.65,23 S6.L
RING
  Bottom 0.254: C13.2 108,13.92 R20.2 J1.2 J1.3
RT_INT  (via drill 0.6)
  Top 0.254: P1.46 62.79,50.48 v62.79,50.21
  Bottom 0.254: U6.18 62.79,38.13 v62.79,50.21
RXD  (via drill 0.6)
  Top 0.254: v52.63,56.56 v74.73,56.56
  Bottom 0.254: P3.3 74.75,68.78 74.75,56.58 v74.73,56.56 | U6.10 52.63,38.13 v52.63,56.56
SCL  (via drill 0.6)
  Top 0.254: P1.44 46.23,49.48 v46.23,49.21
  Bottom 0.254: v46.23,49.21 U6.5
SCLK
  Top 0.254: P1.37 60.67,45.98 R18.2
SCLK_3V  (via drill 0.6)
  Top 0.254: v69.09,46.4 62.37,46.4 R18.1
  Bottom 0.254: U6.23 v69.09,46.4
SDA  (via drill 0.6)
  Top 0.254: P1.45 43.69,49.98 v43.69,49.96
  Bottom 0.254: v43.69,49.96 U6.3
SENSE
  Bottom 0.254: U5.3 100,32.81 98.61,31.41 98.61,26.5 R11.1 102.42,17.84 J1.5
TFT_CS_3V  (via drill 0.6)
  Top 0.254: P1.38 57.28,46.48 57.97,47.16 70.16,47.16 v70.41,46.91
  Bottom 0.254: v70.41,46.91 70.41,38.13 U6.24
TFT_DC_3V  (via drill 0.6)
  Top 0.254: P1.36 v65.33,45.48
  Bottom 0.254: v65.33,45.48 65.33,38.13 U6.22
TFT_RST  (via drill 0.6)
  Top 0.254: 56.2,32.46 P1.10 57.25,32.48 60.33,35.55 64.85,35.55 | 64.85,35.55 67.82,35.55 | 67.82,35.55 70.19,35.55 R8.1 | U1.2 64.85,35.55 | v67.82,38.6 67.82,35.55 | v67.82,50.98 62.87,50.98 R12.1
  Bottom 0.254: v67.82,38.6 v67.82,50.98
TXD  (via drill 0.6)
  Top 0.254: v50.09,61.64 v73.71,61.64
  Bottom 0.254: P3.4 73.71,67.66 v73.71,61.64 | U6.8 50.09,38.13 v50.09,61.64
USB  (via drill 0.6)
  Top 0.813: v87.18,63.67 v71.54,63.67 48.19,63.67 U7.USB
  Bottom 0.61: v87.18,63.67 87.18,61.07 | 87.18,61.07 87.18,60.37 89.28,58.26 89.28,58.08 | 89.28,58.08 U3.2 | U3.5 87.18,61.07 | U4.3 95.74,58.08 91.75,58.08 | 91.75,58.08 89.28,58.08 | D5.A 91.75,58.08
  Bottom 0.813: P3.1 P3.2 v71.54,63.67
VO1
  Bottom 0.254: SP1.1 118.87,34.08 U5.5 106.1,34.08 105.72,33.7 105.72,27.35 108,25.06 C13.1
VO2
  Bottom 0.254: U5.8 119.18,30.27 SP1.2
VOL/SD  (via drill 0.6)
  Top 0.254: R17.2 115.67,18.41 v100.13,33.95
  Bottom 0.254: U5.4 102.1,33.95 v100.13,33.95

### Text on the board
bNames: gbaZero lvl.2 | Adam Feinstein / (C) 1/2017 / Audio fixed by / Dr. Adam T. Barth / Mech help from / Scott Downen / For Saba / Thanks for the / calipers | VO1 | VO2